# EAGLE design cytron-1 (EAGLE 8.6.1)
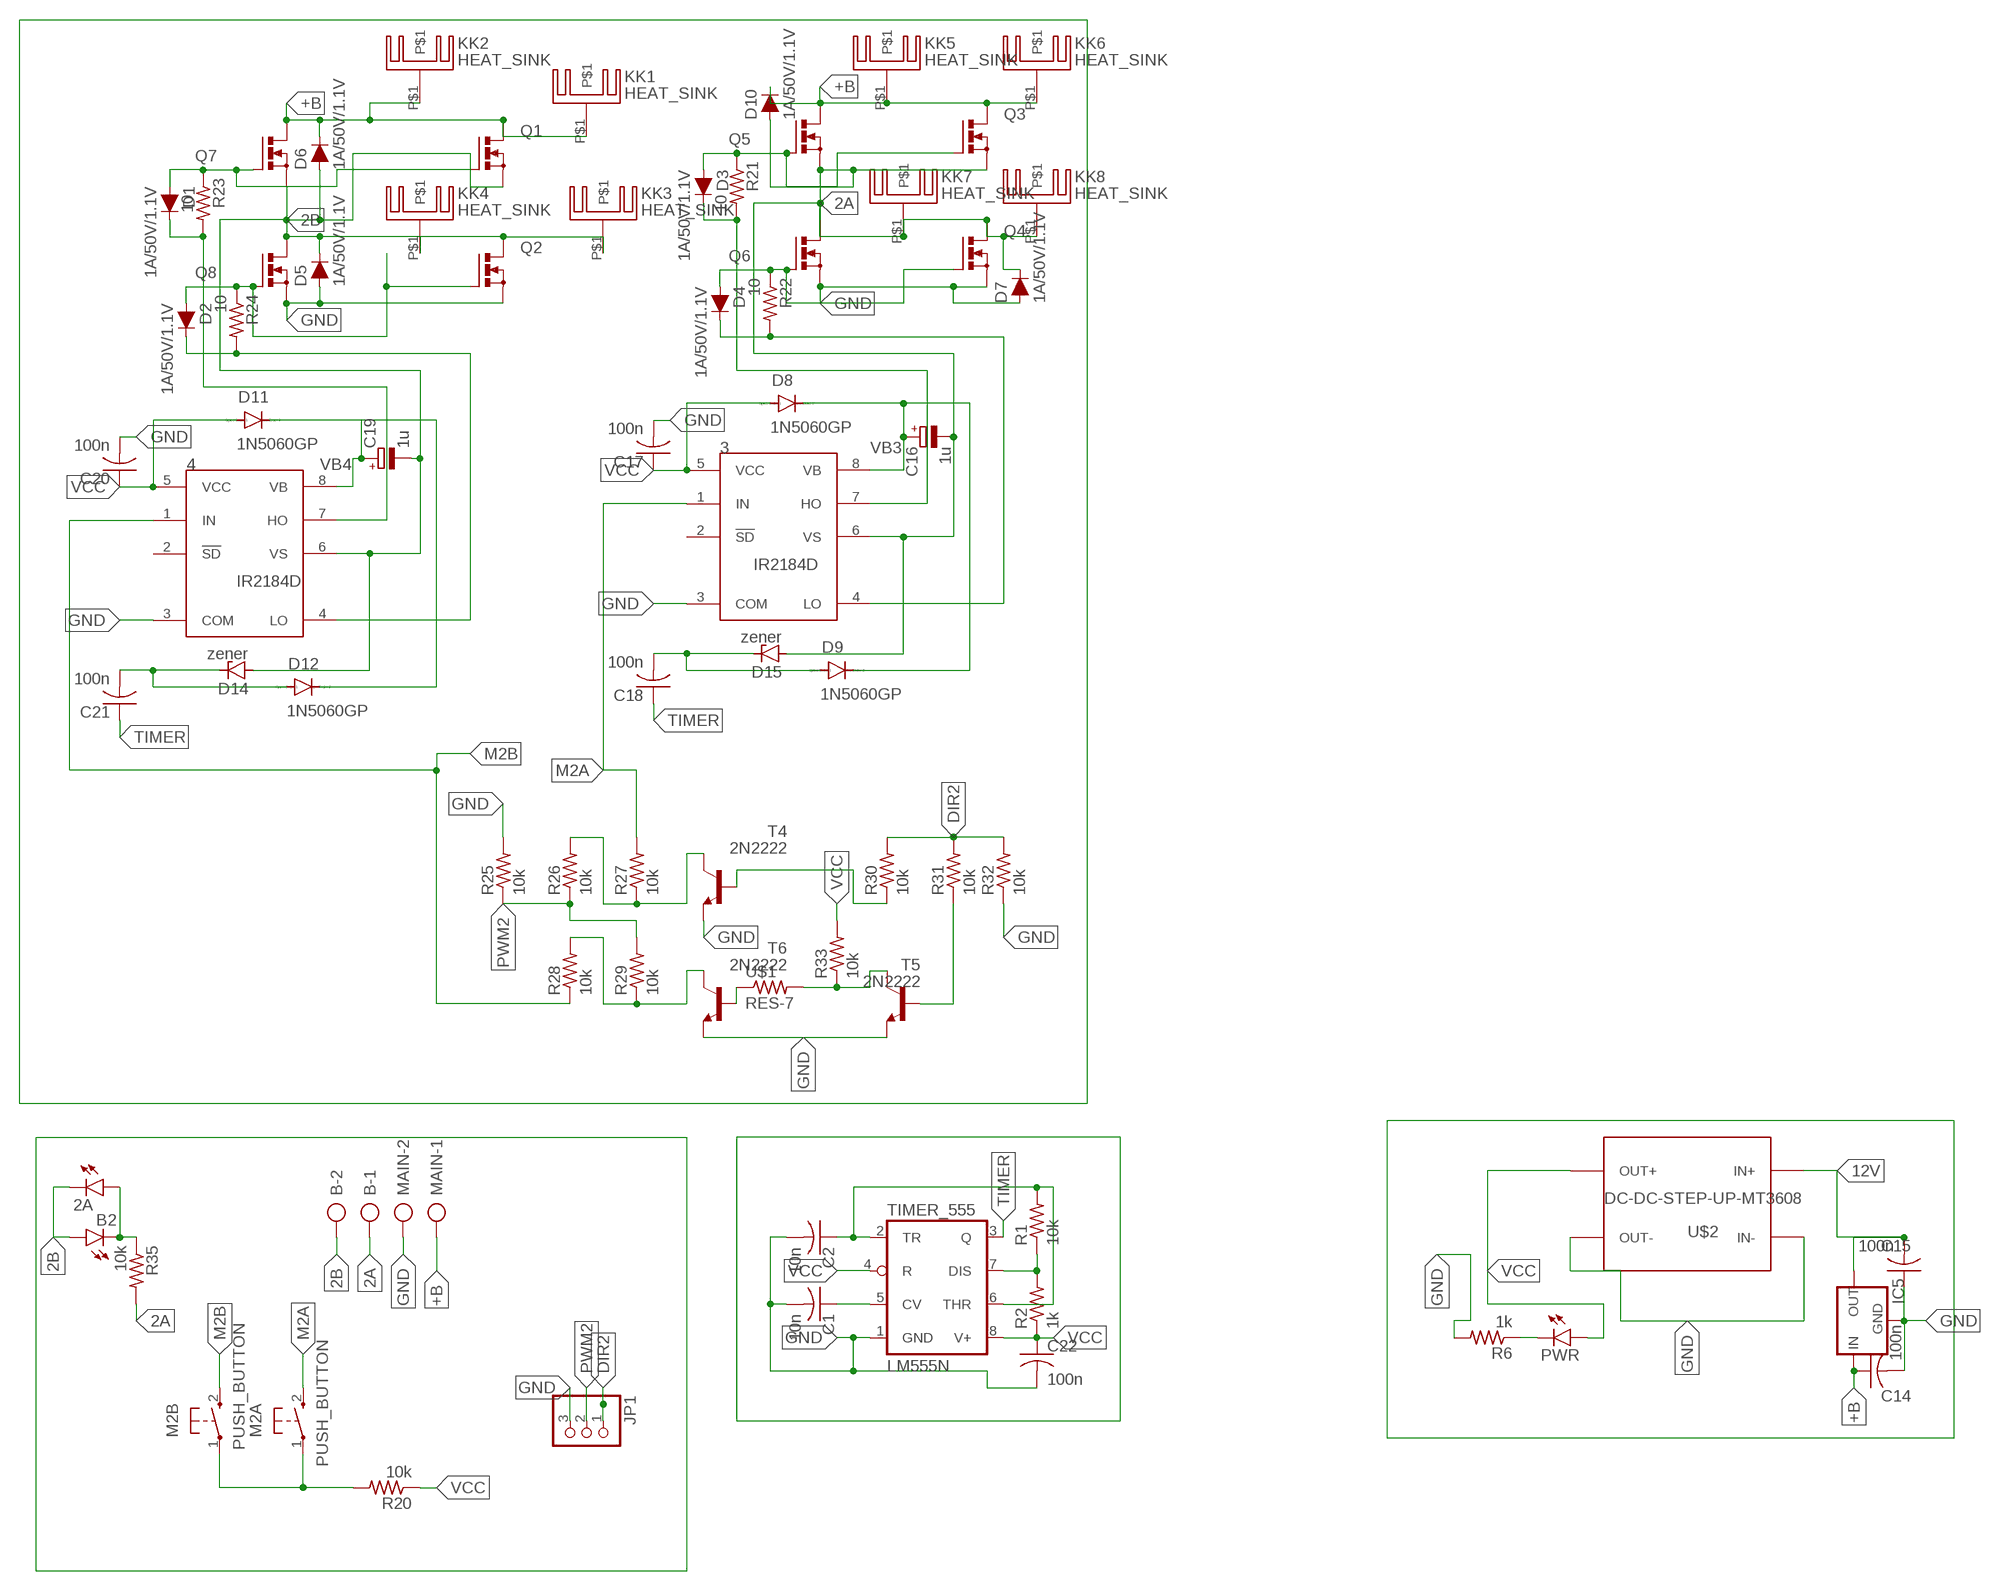
[diagram p0: schematic, sheet 1]

## Parts
2A  LED3MM  [LED3MM]
3  IR2184D  [DIL08]
4  IR2184D  [DIL08]
B  ROSTA.POWER  [W239-302]
B2  LED3MM  [LED3MM]
C1  10n  C-US025-025X050  [C025-025X050]
C2  10n  C-US025-025X050  [C025-025X050]
C14  100n  C-US025-025X050  [C025-025X050]
C15  100n  C-US025-025X050  [C025-025X050]
C16  1u  CPOL-EUE5-5  [E5-5]
C17  100n  C-US025-025X050  [C025-025X050]
C18  100n  C-US025-025X050  [C025-025X050]
C19  1u  CPOL-EUE5-5  [E5-5]
C20  100n  C-US025-025X050  [C025-025X050]
C21  100n  C-US025-025X050  [C025-025X050]
C22  100n  C-US025-025X050  [C025-025X050]
D1  1A/50V/1.1V  DIODE(1A)-PTH  [DIODE-1N4001]
D2  1A/50V/1.1V  DIODE(1A)-PTH  [DIODE-1N4001]
D3  1A/50V/1.1V  DIODE(1A)-PTH  [DIODE-1N4001]
D4  1A/50V/1.1V  DIODE(1A)-PTH  [DIODE-1N4001]
D5  1A/50V/1.1V  DIODE(1A)-PTH  [DIODE-1N4001]
D6  1A/50V/1.1V  DIODE(1A)-PTH  [DIODE-1N4001]
D7  1A/50V/1.1V  DIODE(1A)-PTH  [DIODE-1N4001]
D8  1N5060GP  [DO15-12]
D9  1N5060GP  [DO15-12]
D10  1A/50V/1.1V  DIODE(1A)-PTH  [DIODE-1N4001]
D11  1N5060GP  [DO15-12]
D12  1N5060GP  [DO15-12]
D14  zener  BZD23  [SOD81]
D15  zener  BZD23  [SOD81]
IC5  78XXL  [78XXL]
JP1  PINHD-3_DATA  [1X03_DATA]
KK1  HEAT_SINK  [SK95-2M3]
KK2  HEAT_SINK  [SK95-2M3]
KK3  HEAT_SINK  [SK95-2M3]
KK4  HEAT_SINK  [SK95-2M3]
KK5  HEAT_SINK  [SK95-2M3]
KK6  HEAT_SINK  [SK95-2M3]
KK7  HEAT_SINK  [SK95-2M3]
KK8  HEAT_SINK  [SK95-2M3]
M2A  PUSH_BUTTON  [B3F-10XX]
M2B  PUSH_BUTTON  [B3F-10XX]
MAIN  ROSTA.POWER  [W239-302]
PWR  LED5MM  [LED5MM]
Q1  MOSFET_NTO220BV  [TO220BV]
Q2  MOSFET_NTO220BV  [TO220BV]
Q3  MOSFET_NTO220BV  [TO220BV]
Q4  MOSFET_NTO220BV  [TO220BV]
Q5  MOSFET_NTO220BV  [TO220BV]
Q6  MOSFET_NTO220BV  [TO220BV]
Q7  MOSFET_NTO220BV  [TO220BV]
Q8  MOSFET_NTO220BV  [TO220BV]
R1  10k  R-US_0204/7  [0204/7]
R2  1k  R-US_0204/7  [0204/7]
R6  1k  R-US_0204/7  [0204/7]
R20  10k  R-US_0204/7  [0204/7]
R21  10  R-US_0204/7  [0204/7]
R22  10  R-US_0204/7  [0204/7]
R23  10  R-US_0204/7  [0204/7]
R24  10  R-US_0204/7  [0204/7]
R25  10k  R-US_0204/7  [0204/7]
R26  10k  R-US_0204/7  [0204/7]
R27  10k  R-US_0204/7  [0204/7]
R28  10k  R-US_0204/7  [0204/7]
R29  10k  R-US_0204/7  [0204/7]
R30  10k  R-US_0204/7  [0204/7]
R31  10k  R-US_0204/7  [0204/7]
R32  10k  R-US_0204/7  [0204/7]
R33  10k  R-US_0204/7  [0204/7]
R35  10k  R-US_0204/7  [0204/7]
T4  2N2222  [TO18]
T5  2N2222  [TO18]
T6  2N2222  [TO18]
TIMER_555  LM555N  [DIL08]
U$1  RES-7  [0204/7]
U$2  DC-DC-STEP-UP-MT3608  [DC-DC-STEP-UP-MT3608]

## Nets
2A: 3.6(VS) B.1 C16.- D7.C D10.A D15.A KK7.P$1 KK8.P$1 Q3.S Q4.D Q5.S Q6.D R35.2
2B: 2A.K(C) 4.6(VS) B2.A B.2 C19.- D5.C D6.A D14.A KK3.P$1 KK4.P$1 Q1.S Q2.D Q7.S Q8.D
12V: C15.2 IC5.OUT U$2.IN+
+B: C14.1 D6.C D10.C IC5.IN KK1.P$1 KK2.P$1 KK5.P$1 KK6.P$1 MAIN.1 Q1.D Q3.D Q5.D Q7.D
DIR2: JP1.1 R30.2 R31.2 R32.2
GND: 3.3(COM) 4.3(COM) C1.2 C2.2 C14.2 C15.1 C17.2 C20.2 C22.2 D5.A D7.A IC5.GND JP1.3 MAIN.2 Q2.S Q4.S Q6.S Q8.S R6.2 R25.2 R32.1 T4.1(E) T5.1(E) T6.1(E) TIMER_555.1(GND) U$2.IN- U$2.OUT-
M2A: 3.1(IN) M2A.2(S) R27.2
M2B: 4.1(IN) M2B.2(S) R28.1
N$1: PWR.K(C) R6.1
N$2: C1.1 TIMER_555.5(CV)
N$3: R1.1 R2.2 TIMER_555.7(DIS)
N$4: C2.1 R1.2 TIMER_555.2(TR) TIMER_555.6(THR)
N$6: D4.A Q4.G Q6.G R22.1
N$7: M2A.1(P) M2B.1(P) R20.2
N$8: T6.2(B) U$1.1
N$25: D3.A Q3.G Q5.G R21.1
N$26: 3.4(LO) D4.C R22.2
N$30: 3.7(HO) D3.C R21.2
N$31: C18.2 D9.A D15.C
N$32: D2.A Q2.G Q8.G R24.1
N$33: D1.A Q1.G Q7.G R23.1
N$34: 4.4(LO) D2.C R24.2
N$35: 4.7(HO) D1.C R23.2
N$36: C21.2 D12.A D14.C
N$37: R28.2 R29.1 T6.3(C)
N$38: R26.2 R27.1 T4.3(C)
N$39: R30.1 T4.2(B)
N$40: R33.1 T5.3(C) U$1.2
N$41: R31.1 T5.2(B)
N$46: 2A.A B2.K(C) R35.1
PWM2: JP1.2 R25.1 R26.1 R29.2
TIMER: C18.1 C21.1 TIMER_555.3(Q)
VB3: 3.8(VB) C16.+ D8.C D9.C
VB4: 4.8(VB) C19.+ D11.C D12.C
VCC: 3.5(VCC) 4.5(VCC) C17.1 C20.1 C22.1 D8.A D11.A PWR.A R2.1 R20.1 R33.2 TIMER_555.4(R) TIMER_555.8(V+) U$2.OUT+
Unconnected: 3.2(!SD) 4.2(!SD)

## Library data of the parts
2A B2 PWR = led:LED: LED OSRAM: - CHIPLED LG R971, LG N971, LY N971, LG Q971, LY Q971, LO R971, LY R971 LH N974, LH R974 LS Q976, LO Q976, LY Q976 LO Q996 - Hyper CHIPLED LW Q18S LB Q993, LB Q99A, LB R99A - SideLED LS A670, LO A670, LY A670, LG A670, LP A670 LB A673, LV A673, LT A673, LW A673 LH A674 LY A675 LS A676, LA A676, LO A676, LY A676, LW A676 LS A679, LY A679, LG A679 - Hyper Micro SIDELED® LS Y876, LA Y876, LO Y876, LY Y876 LT Y87S - SmartLED LW L88C, LW L88S LB L89C, LB L89S, LG L890 LS L89K, LO L89K, LY L89K LS L896, LA L896, LO L896, LY L896 - TOPLED LS T670, LO T670, LY T670, LG T670, LP T670 LSG T670, LSP T670, LSY T670, LOP T670, LYG T670 LG T671, LOG T671, LSG T671 LB T673, LV T673, LT T673, LW T673 LH T674 LS T676, LA T676, LO T676, LY T676, LB T676, LH T676, LSB T676, LW T676 LB T67C, LV T67C, LT T67C, LS T67K, LO T67K, LY T67K, LW E67C LS E67B, LA E67B, LO E67B, LY E67B, LB E67C, LV E67C, LT E67C LW T67C LS T679, LY T679, LG T679 LS T770, LO T770, LY T770, LG T770, LP T770 LB T773, LV T773, LT T773, LW T773 LH T774 LS E675, LA E675, LY E675, LS T675 LS T776, LA T776, LO T776, LY T776, LB T776 LHGB T686 LT T68C, LB T68C - Hyper Mini TOPLED® LB M676 - Mini TOPLED Santana® LG M470 LS M47K, LO M47K, LY M47K Source: http://www.osram.convergy.de LUXEON: - LUMILED® LXK2-PW12-R00, LXK2-PW12-S00, LXK2-PW14-U00, LXK2-PW14-V00 LXK2-PM12-R00, LXK2-PM12-S00, LXK2-PM14-U00 LXK2-PE12-Q00, LXK2-PE12-R00, LXK2-PE12-S00, LXK2-PE14-T00, LXK2-PE14-U00 LXK2-PB12-K00, LXK2-PB12-L00, LXK2-PB12-M00, LXK2-PB14-N00, LXK2-PB14-P00, LXK2-PB14-Q00 LXK2-PR12-L00, LXK2-PR12-M00, LXK2-PR14-Q00, LXK2-PR14-R00 LXK2-PD12-Q00, LXK2-PD12-R00, LXK2-PD12-S00 LXK2-PH12-R00, LXK2-PH12-S00 LXK2-PL12-P00, LXK2-PL12-Q00, LXK2-PL12-R00 Source: www.luxeon.com KINGBRIGHT: KA-3528ASYC Source: www.kingbright.com
3 4 = irs:IR2184
B MAIN = MIA_LIBRARY-2-2-2:ROSTA.POWER: WAGO SCREW CLAMP; OC_FARNELL: unknown; OC_NEWARK: unknown
C1 C2 C14 C15 C17 C18 C20-C22 = rcl8:C-US: CAPACITOR, American symbol; SPICEPREFIX: C
C16 C19 = rcl8:CPOL-EU: POLARIZED CAPACITOR, European symbol; SPICEPREFIX: C
D1-D7 D10 = MIA_LIBRARY-2-2-2:DIODE(1A): Diode These are standard reverse protection diodes and small signal diodes. SparkFun Products: SparkFun SparkPunk Sound Kit <https://www.sparkfun.com/products/11177> SparkFun ESP8266 Thing <https://www.sparkfun.com/products/13231>; PROD_ID: DIO-09176
D8 D9 D11 D12 = diode:1N5060GP: DIODE controlled avalanche rectifier
D14 D15 = diode:BZD23: Z DIODE
IC5 = MIA_LIBRARY-2-2-2:78XXL: VOLTAGE REGULATOR
JP1 = MIA_LIBRARY-2-2-2:PINHD-3_DATA: PIN HEADER
KK1-KK8 = MIA_LIBRARY-2-2-2:HEAT_SINK: HEATSINK manufacturer Fischer/distributor Buerklin
M2A M2B = MIA_LIBRARY (1):PUSH_BUTTON: OMRON SWITCH
Q1-Q8 = MIA_LIBRARY-2-2-2:MOSFET_N: Power MOSFET N-Channel
R1 R2 R6 R20-R33 R35 = rcl8:R-US_: RESISTOR, American symbol; SPICEPREFIX: R
T4-T6 = transistor:2N2222: NPN TRANSISTOR
TIMER_555 = linear:*555: TIMER
U$1 = MIA_LIBRARY-2-2-2:RES-7
U$2 = MIA_LIBRARY-2-2-2:DC-DC-STEP-UP-MT3608: DC/DC Step-Up Regulator based on MT3608 chip MT3608 datasheet available here: https://www.olimex.com/Products/Breadboarding/BB-PWR-3608/resources/MT3608.pdf Click here to find device on ebay.com <http://www.ebay.com/sch/mt3608+module>

## Board
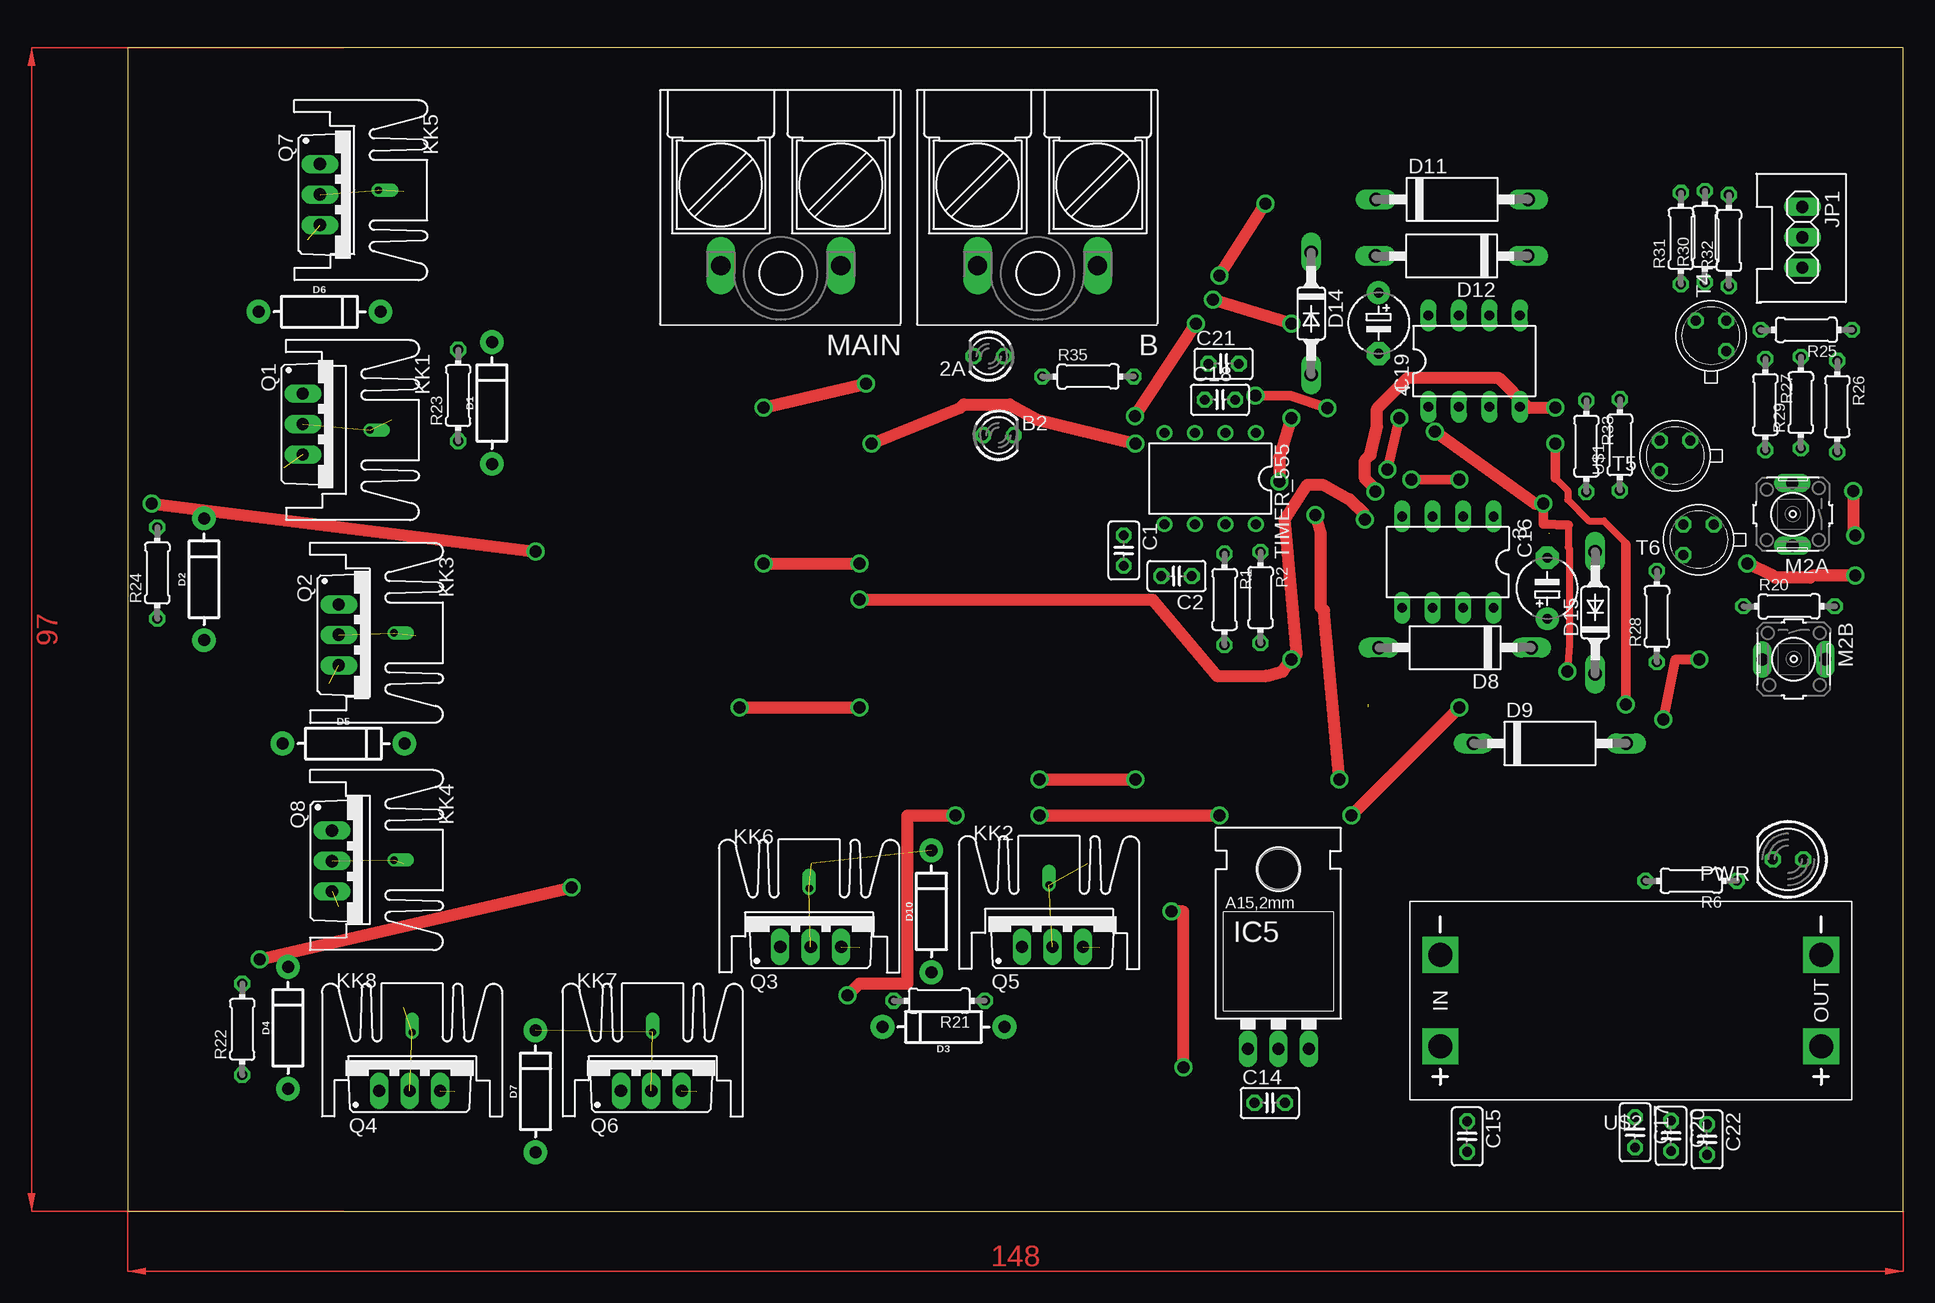
[diagram p1: board, top side]
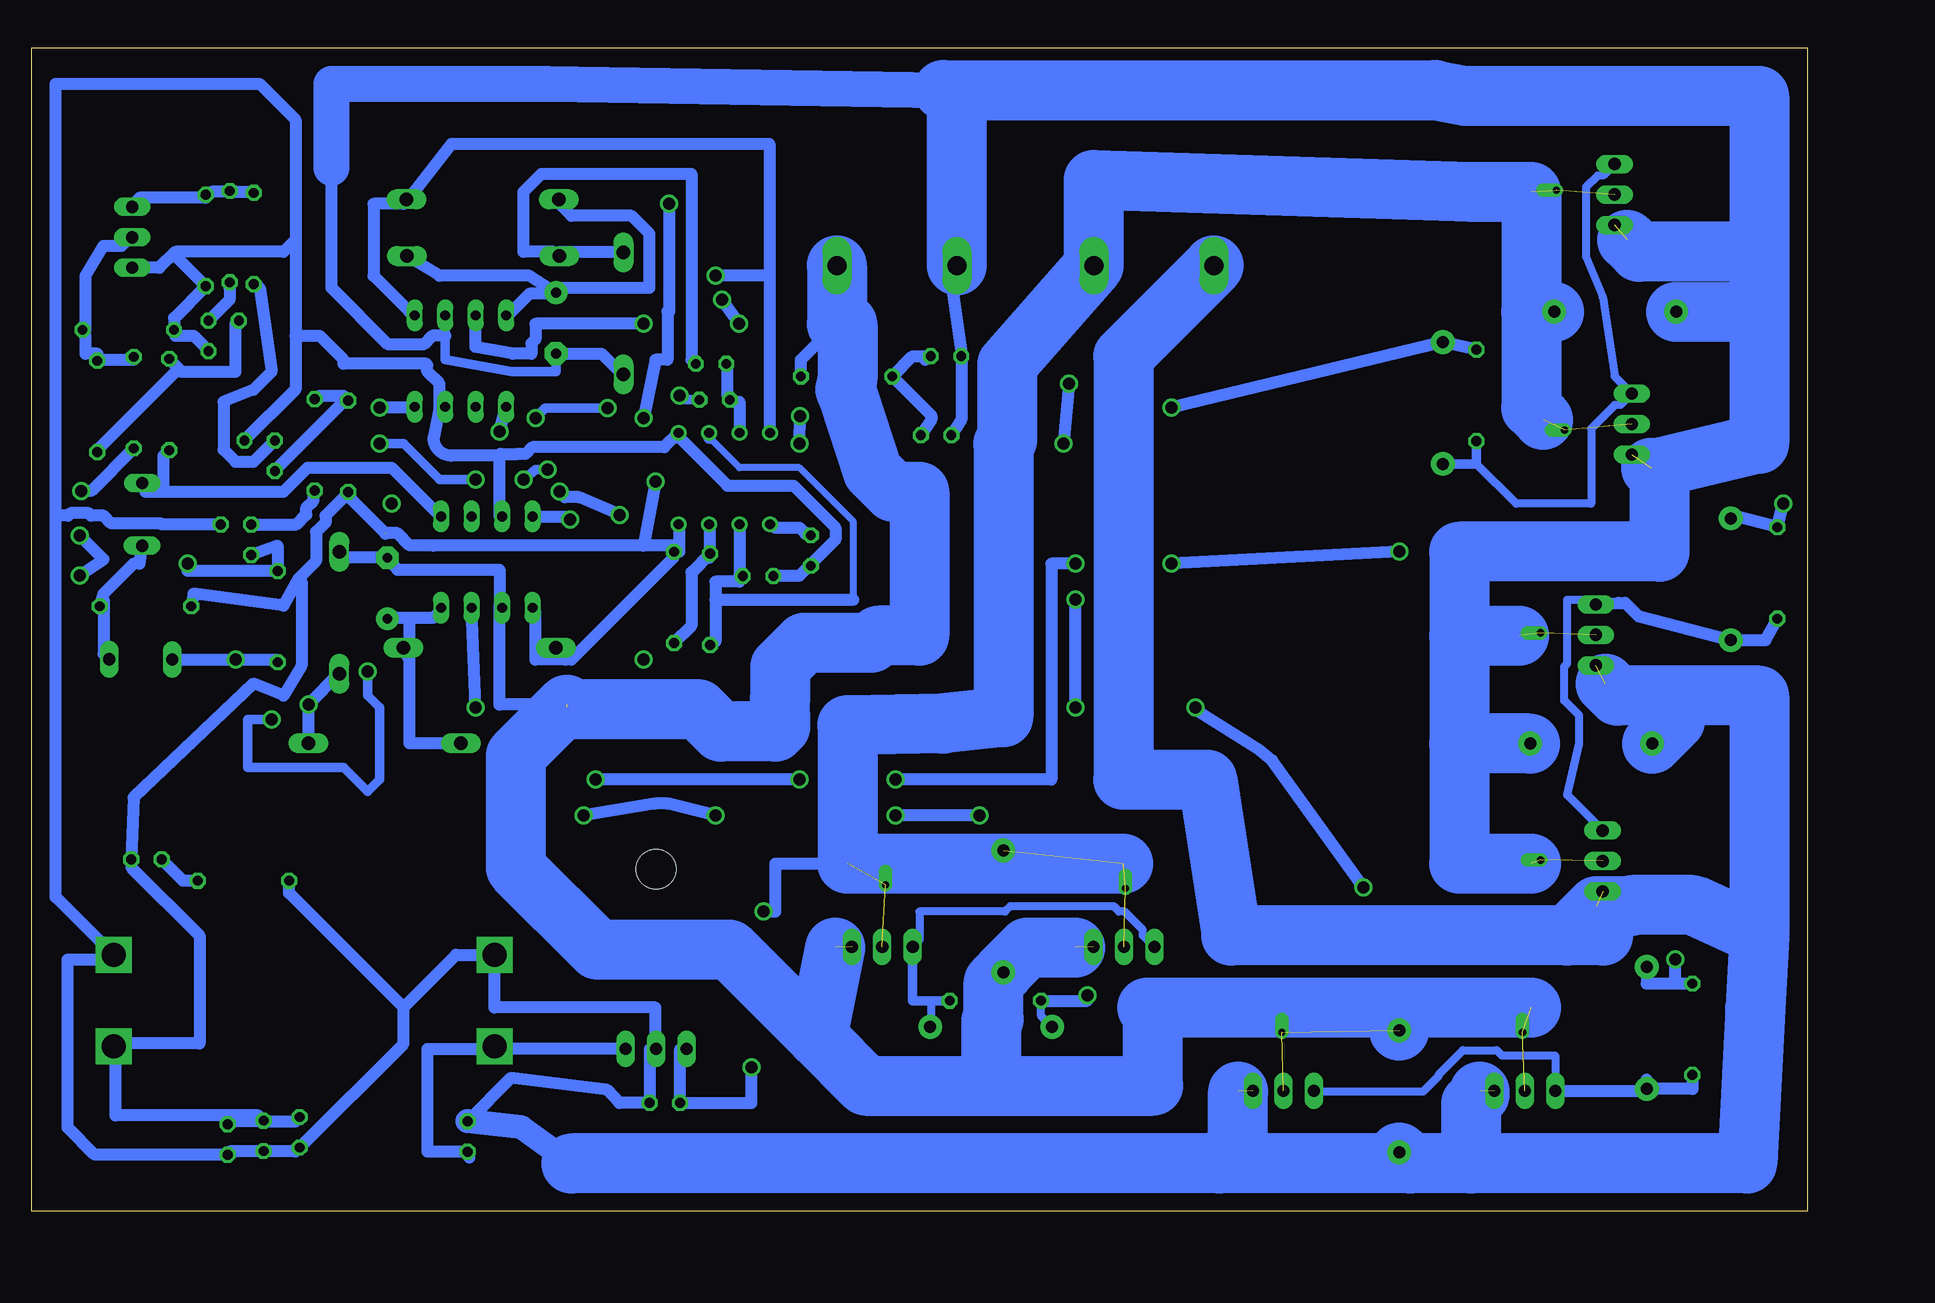
[diagram p2: board, bottom side, seen from below]

Size 148 x 97 mm. Coordinates in mm from the lower left corner, seen from the top.
Outline: 0,0 148,0 148,97 0,97 0,0
Copper layers (1*16): Top 0.035mm / dielectric 1.5mm / Bottom 0.035mm
Design rules "default *": minimum track width 1mm, minimum drill 0.35mm, track to track 0.6mm, track to pad 0.5mm, pad to pad 0.5mm, via to via 0.6mm, smd to smd 6mil, copper to edge 40mil, drill to drill 6mil, minimum pad ring 10mil, minimum via ring 8mil, stop-mask expansion 4mil, vias tented up to drill 0mil, thermal gap 10mil

### Footprints (pad centres in the part's own frame; a part is rotated, then mirrored left to right if it is on the bottom)
LED3MM = drill 0.813 octagon: A -1.27,0; K 1.27,0
DIL08 = drill 0.813 long: 1 -3.81,-3.81; 2 -1.27,-3.81; 3 1.27,-3.81; 4 3.81,-3.81; 5 3.81,3.81; 6 1.27,3.81; 7 -1.27,3.81; 8 -3.81,3.81
W239-302 = drill 1.6 long: 1 -5,5; 2 5,5
C025-025X050 = drill 0.813 octagon: 1 -1.27,0; 2 1.27,0
E5-5 = drill 0.813 pad 1.905: + -2.54,0 | drill 0.813 pad 1.905 octagon: - 2.54,0
DIODE-1N4001 = drill 1 pad 1.981: A -5.08,0; C 5.08,0
DO15-12 = drill 1.118 long: A 6.35,0; C -6.35,0
SOD81 = drill 1.118 long: A 5.08,0; C -5.08,0
78XXL = drill 1.016 long: GND 0,-3.81; IN -2.54,-3.81; OUT 2.54,-3.81 | hole 3.302: 0,11.176
1X03_DATA = drill 1.016 long: 1 -2.54,0; 2 0,0; 3 2.54,0
SK95-2M3 = drill 0.6 offset: P$1 0,2
B3F-10XX = drill 1.016 long: 1 0.013,2.636; 2 0.029,-2.605
LED5MM = drill 0.813 octagon: A -1.27,0; K 1.27,0
TO220BV = drill 1.016 long: D 0,-2.54; G -2.54,-2.54; S 2.54,-2.54
0204/7 = drill 0.813 octagon: 1 -3.81,0; 2 3.81,0
TO18 = drill 0.813 octagon: 1 -1.27,-1.27; 2 1.27,-1.27; 3 1.27,1.27
DIL08' = drill 0.813 pad 1.27: 1 -3.81,-3.81; 2 -1.27,-3.81; 3 1.27,-3.81; 4 3.81,-3.81; 5 3.81,3.81; 6 1.27,3.81; 7 -1.27,3.81; 8 -3.81,3.81
DC-DC-STEP-UP-MT3608 = drill 2 pad 2.8 square: IN+ 15.24,3.81; IN- 15.24,-3.81; OUT+ -16.51,3.81; OUT- -16.51,-3.81

### Placement (x,y rotation side)
2A  71.78,71.29 180 top
3  110.05,54.12 180 top
4  112.25,70.88 0 top
B  75.86,83.84 180 top
B2  72.6,64.71 0 top
C1  83.04,55.09 270 top
C2  87.44,52.96 180 top
C14  95.21,9.04 0 top
C15  111.66,6.24 270 top
C16  118.34,51.94 90 top
C17  125.66,6.59 270 top
C18  91.06,67.66 0 top
C19  104.28,74.05 270 top
C20  128.66,6.29 270 top
C21  91.36,70.66 0 top
C22  131.66,5.99 270 top
D1  30.37,67.39 90 top
D2  6.37,52.69 90 top
D3  68.01,15.37 180 top
D4  13.37,15.29 90 top
D5  18,39 0 top
D6  16,75 0 top
D7  34,10 90 top
D8  110.66,46.99 180 top
D9  118.56,39.01 0 top
D10  67,25 90 top
D11  110.41,84.36 0 top
D12  110.37,79.64 180 top
D14  98.66,74.85 270 top
D15  122.34,49.91 90 top
IC5  95.94,17.35 0 top
JP1  139.61,81.2 270 top
KK1  18.21,65.13 270 top
KK2  76.82,25.21 0 top
KK3  20.21,48.23 270 top
KK4  20.21,29.28 270 top
KK5  18.91,85.13 270 top
KK6  56.82,24.91 0 top
KK7  43.77,12.91 0 top
KK8  23.72,12.91 0 top
M2A  138.8,58.12 180 top
M2B  138.88,46.04 270 top
MAIN  54.45,83.84 180 top
PWR  138.42,29.34 180 top
Q1  17.15,65.63 270 top
Q2  20.15,48.06 270 top
Q3  56.95,24.58 0 top
Q4  23.52,12.58 0 top
Q5  77.09,24.58 0 top
Q6  43.66,12.58 0 top
Q7  18.58,84.77 270 top
Q8  19.58,29.2 270 top
R1  91.44,51.02 270 top
R2  94.44,51.18 270 top
R6  130.34,27.56 180 top
R20  138.5,50.44 0 top
R21  67.66,17.56 180 top
R22  9.56,15.18 90 top
R23  27.56,68.02 90 top
R24  2.48,53.22 90 top
R25  139.94,73.48 180 top
R26  142.52,67.1 270 top
R27  136.52,67.26 270 top
R28  127.48,49.58 90 top
R29  139.48,67.42 90 top
R30  131.48,81.26 90 top
R31  129.48,81.1 90 top
R32  133.48,80.94 90 top
R33  121.6,63.78 270 top
R35  80.06,69.6 0 top
T4  131.99,72.98 90 top
T5  128.99,62.99 180 top
T6  130.96,55.99 180 top
TIMER_555  LM555N  [DIL08']  90.25,61.09 180 top
U$1  124.4,63.9 90 top
U$2  124.66,17.57 180 top

### Tracks (layer width: path | path; a pad name or v marks a point on that pad's centre or on a via)
2A  (7 unrouted)
  Bottom 1: 109,50.5 109,53.5 117.5,53.5 118,54 C16.- 118.5,54.5 122,54.5 D15.A | 109,50.5 3.6 | 103.38,42.25 109,42.25 109,50.5 | R35.2 83.87,70.99 80.86,74
  Bottom 5: B.1 80.86,74 80,74 80,69.32 80.18,68.55 80.13,68.41 80.13,68.39 79.9,67.82 77.9,61.71 76.19,60 74,60 74,48 77.41,48 78.01,47.4 83.6,47.4 85.6,45.4 85.6,42.76 85.64,42.72 85.6,40.45 85.6,40.4 86,40 90.56,40 92.41,41.85 103.18,41.85 103.38,42.05 | 103.38,42.25 107.63,38 107.63,28.63 100.83,21.84 89.83,21.84 82.5,14.5 | 68,10.48 78.48,10.48 82.5,14.5 | 68,10.48 54.52,10.48 54.52,16.52 55,17 34,17 | 82.5,14.5 81,22 | 68,10.48 68,15.85 67.81,16.04 67.81,19.11 D10.A 67,20 65,22 61,22 | 34,17 23,17 | D7.C 34,17
2B  (6 unrouted)
  Bottom 0.8: 4.6 113.52,73 113.52,71 108,70 104.28,70 C19.-
  Bottom 1: D14.A 99,70 100.5,71.5 104,71.5 C19.- | B2.A 70.5,66 70.5,71 2A.K 70.5,71.5 71.5,78.5 71,78.5 B.2 70.5,79 | 123,87 123,77 118.27,72.27 115.33,72.27 114.6,73 113.52,73
  Bottom 3: 123,87 123,94 105,94 72,93.48
  Bottom 5: B.2 70.86,92.62 72,93.48 31,93.48 28.52,93 4,93 4,80 | 4,80 4,75 | 4,75 4,64 12.3,62 | 12.3,62 12.33,61.97 13,61.97 | 4,80 14,80 15,81 | 29,48 29,55 12.3,55 12.3,62 | 29,48 29,39 | 29,39 29,29 23,29 | D6.A 4,75 | 29,48 24,48 | D5.C 29,39
12V
  Bottom 1: 111.5,4.5 C15.2 115,4.97 115,13.54 109.42,13.54 | IC5.OUT 109.42,13.54 | 109.42,13.54 U$2.IN+
+B  (via drill 1)  (9 unrouted)
  Top 1: v88,12 88,25 v87,25
  Bottom 1: IC5.IN 93.94,13.54 C14.1 88,9.04 v88,12 | v87,25 86,25 86,29 80,29
  Bottom 5: 57,29 80,29 80,40.51 72,40.66 72.07,40.66 67,41.2 67,64 66.69,64.32 66.69,70.61 MAIN.1 59.45,86 28,85 23,85 23,75 | 22,66 23,67 23,75 | D6.C 23,75
DIR2
  Bottom 1: R31.2 129.5,85 131,85 R30.2 131.5,85 133,85 R32.2 133.5,84.5 139,84.5 139.5,84 JP1.1
GND  (4 unrouted)
  Bottom 1: T4.1 133.5,72 134.5,73 136,73 R25.2 136.13,74.48 R32.1 136,79.65 136,80 | C2.2 86,53 84,53 83.5,53.5 C1.2 83,54 81,56 81,57 84.5,60.5 90,60.5 94,64.5 TIMER_555.1 | 114,67 114.5,64.5 arc-90 113,63 109,63 | 114,67 4.3 | 94.5,64.5 TIMER_555.1 | 111,7.5 C15.1 108.05,11.12 100,10.12 99,9.04 C14.2 96.48,13.54 IC5.GND 96,13.54 96,17 109.42,17 U$2.IN- 112.62,21.38 117,17 | 117,17 117,13.98 C17.2 126,5 128.5,5 C20.2 129,5 131.5,5 C22.2 142.72,4.72 145,7 145,21 141.55,21 U$2.OUT- 146,26.21 146,58 | 117,17 126.53,26.53 R6.2 | 146,58 146,94 129,94 126,91 126,81 | 126,81 127,80 136,80 | 136,80 137.34,78.66 JP1.3 | T5.1 126,68.52 126,73 | 126,81 126,73 | 126,73 124,73 122,71 122,70.67 115.1,70.67 115.11,70.66 115.02,70.53 115.02,70.02 114,69 114,67 | 107.54,63.15 107.57,63.12 | 108.65,58.35 109,58 3.3 arc90 109,58.15 109,63 | 109,63 arc90 108.85,63.15 107.54,63.15 | T6.1 137.17,57.26 137.25,57.35 141.35,57.35 142,58 143.03,58 143.23,58.2 144.77,58.2 144.97,58 146,58 | 107.54,63.15 106.82,63.15 106.27,63.7 95.26,63.7 TIMER_555.1
  Bottom 2: 103,4 107.15,7 C15.1
  Bottom 5: 4,23 4,43 11,43 | 4,23 4.32,16.91 5,4 28,4 | 28,4 33.08,4 | 33.08,4 49,4 | 49,4 103,4 | 4,23 9.54,25.54 14.62,25.54 14.72,25.44 17.56,25.44 20,23 | 11,43 15.81,43 16.81,44 | MAIN.2 57,71.29 57,36 50,36 48,23 20,23 | 17,23 20,23 | D5.A 11,40.92 11,43 | 49,4 47.42,5.58 47.42,10 | 28,4 28,9 27.28,9.72 27.28,10 | D7.A 33.08,4
M2A
  Bottom 1: 137,60 138.5,60 M2A.2 | 137,60 127,60 125,62 118,62 114,58 3.1 | 137,60 137,63 R27.2
M2B  (via drill 1)
  Top 0.6: 120.09,57.21 120.09,55.35 120.19,55.25 120.19,47.19 v120,45
  Top 0.8: 117.32,59 v118,59 118,57.3 120.09,57.21 | v128,41 129,46 v131,46
  Top 1: 117.32,59 v108.99,64.99
  Bottom 0.8: v120,45 120,43 119,42 119,36 120,35 122,37 130,37 130,41 v128,41
  Bottom 1: R28.1 127.5,46 v131,46 136,46 M2B.2 | v108.99,64.99 4.1
N$1
  Bottom 1: R6.1 135.37,27.56 PWR.K
N$2
  Bottom 1: C1.1 83.5,56.5 84,57 86,57 TIMER_555.5
N$3
  Bottom 1: R1.1 91.5,55 91.5,57 TIMER_555.7 | 91.5,54.5 R1.1 | R1.1 93,53.27 93,48.81 R2.2
N$4
  Bottom 0.6: 91.5,64.5 89,62 84,62 79.5,57.5 79.5,51
  Bottom 1: TIMER_555.6 89,57 89,53 C2.1 89,52.5 91,52.5 91,51 | 91,51 91,47.5 R1.2 | 91,51 79.5,51 | 91.5,64.5 TIMER_555.2
N$6
  Bottom 0.65: Q6.G 41.08,10 32,10 30.71,11.29 30.71,11.42 28.7,13.43 25.86,13.43 25.44,13 21,13 21,10.06 Q4.G
  Bottom 1: Q4.G 13.37,10.04 D4.A | 13.37,11 D4.A | R22.1 9.56,10.21 D4.A
N$7
  Bottom 1: M2A.1 139,54 139.5,54 142,51.5 R20.2 142,51 142,46.5 M2B.1
N$8
  Bottom 1: U$1.1 124.5,60 124.5,59.26 125.1,58.66 125.1,58.07 125.91,57.26 T6.2
N$25
  Bottom 0.65: Q3.G 55.36,22.99 55.36,23.46 56.9,25 57.37,25 57.8,25.43 66.42,25.43 66.84,25 74,25 74,22.59 Q5.G | D3.A 73,15.46 73,17.56
  Bottom 0.8: Q5.G 74.55,17.56 73,17.56 R21.1
N$26  (via drill 1)
  Top 1: v11,21 v37,27 | v51,42 v61,42 | v61,51 85.44,51 90.79,44.65 94.93,44.65 96.28,45 v97,46 97.46,46.46 96.46,57.67 98.36,60.58 99.64,60.58 101.86,59.35 103.13,58.08 v103.13,57.69
  Bottom 0.8: 106.17,58 3.4
  Bottom 1: D4.C 13.37,18.99 11,18.99 | 11,18.99 R22.2 | 11,18.99 v11,21 | v37,27 44.6,37.6 45.6,38.41 51,41.81 v51,42 | v61,42 v61,51 | 3.4 103.13,57.93 v103.13,57.69
N$30  (via drill 1)
  Top 1: v76,33 v91,33 | v102,33 v111,42 | v60,18 61,19 65,19 65,33 v69,33
  Bottom 0.65: D3.C 63.85,16.29 R21.2
  Bottom 1: v69,33 v76,33 | v91,33 95,34 96,34 v102,33 | v111,42 3.7 | R21.2 60,17.56 v60,18
N$31  (via drill 1)
  Top 0.6: 119,61.14 120.04,60.1 120.04,59.32 121.8,57.57 123.06,57.57 124.91,55.72 124.91,55.58
  Top 0.8: v94,68 96.94,68 v100,66.94 | v106,66.15 v105,61.85 | v107,61 v111,61 | v119,64 119,61.14 | 124.91,55.58 v124.91,42.26
  Bottom 0.8: C18.2 93.66,67.66 v94,68 | v100,66.94 105.21,66.94 v106,66.15 | v105,61.85 106,61.85 v107,61 | v111,61 114,61 117,64 v119,64
  Bottom 1: D9.A v124.91,42.26 D15.C
N$32
  Bottom 0.65: Q8.G 20,34.7 19,39 19,41.35 20.23,42.58 20.23,45.42 20,45.65 20,51 18.01,51 Q2.G
  Bottom 1: Q2.G 15.73,50.72 15.16,50.72 14.05,49.61 D2.A 3.48,47.61 R24.1
N$33
  Bottom 0.65: Q7.G 16.99,86.36 17.46,86.36 18.43,85.39 18.43,79.58 17.04,76.2 16.04,69.6 Q1.G 15.56,67.22 16.03,67.22 18,65.25 18,59 24.25,59 27.56,62.31
  Bottom 0.8: D1.A 27.56,62.31 R23.1
N$34  (via drill 1)
  Top 1: v2,59 v34,55 | v53,54 v61,54 | v76,36 v84,36 | v101,36 99.73,50.1 99.46,50.36 99.46,56.58 v99,58.04 | v104,60 104,60.23 103.15,61.08 103.15,62.62 103.61,63.08 104.15,65.38 104.15,66.92 106.72,69.49 114.25,69.49 116.74,67 v119,67
  Bottom 1: D2.C 6.37,58.03 R24.2 v2,59 | v34,55 v53,54 | v61,54 63,54 63,36 v76,36 | v84,36 v101,36 | v99,58.04 98.86,58.04 102.36,59.54 103.54,59.54 v104,60 | 4.4 116.06,67 v119,67
N$35  (via drill 1)
  Top 1: v53,67 v61.54,69 | v62,64 69.41,67 69.68,67.27 73.52,67.27 75.79,66 v84,64 | v83.96,66.29 v89.04,74 | v90.46,76 v97,74
  Bottom 1: R23.2 D1.C v53,67 | v61.54,69 v62,64 | v84,64 v83.96,66.29 | v89.04,74 v90.46,76 | v97,74 106,74 106,72.69 106.33,72.36 106.33,71.5 107.86,71.5 110.99,72.07 4.7
N$36
  Bottom 1: C21.2 93,71 93,86.5 105.5,86.5 107,85 107,80 104.5,80 D12.A 104,80 99,80 D14.C
N$37  (via drill 1)
  Top 1: v144,56.35 143.85,56.5 v143.85,60.05 | v144,53 140.42,53 140.24,52.82 137.34,52.82 137.16,53 v135,54
  Bottom 1: T6.3 127.5,55.5 127.5,53.5 R28.2 135,53.39 v135,54 | v144,56.35 142,54.35 v144,53 | R29.1 143.04,60.05 v143.85,60.05
N$38
  Bottom 1: 135.75,70.25 136.5,71 R27.1 | 135.75,70.25 135.5,70 131,70 131,74 T4.3 | 135.75,70.25 142.5,63.5 R26.2
N$39
  Bottom 1: T4.2 133,74.5 131.5,76 131.5,77 R30.1
N$40
  Bottom 1: U$1.2 124,68 122,68 R33.1 122,67.5 127.5,62 T5.3
N$41
  Bottom 1: T5.2 128,64 129.5,62.5 131,62.5 132,63.5 132,67.5 129.5,68.5 128,70 129,77 R31.1
N$46
  Bottom 1: B2.K 73,66 73,66.35 R35.1 74.56,71.29 2A.A 73.5,71
PWM2
  Bottom 1: R29.2 139.5,71 142.5,71 R26.1 142.5,71.5 143.5,71.5 143.5,73 R25.1 143.5,73.5 143.5,78 142,80.5 140.5,80.5 140,81 JP1.2
TIMER
  Bottom 1: TIMER_555.3 89,65 89,67.5 89.5,67.5 C18.1 90,68 90,70.5 C21.1
VB3
  Bottom 1: 116.5,49.5 118,49.5 C16.+ | 116.5,49.5 114.5,49.5 114,50 3.8 | 116.5,46 116.5,49.5 | 116.5,46 D8.C | D9.C 116.5,39.01 116.5,46
VB4
  Bottom 1: 4.8 108,75 106.5,76.5 104.5,76.5 C19.+ | D12.C 116.5,79.5 114,78 106.5,78 C19.+ | D11.C 104,84 103,83 98,83 96.5,81.5 96.5,77 104,77 C19.+
VCC  (via drill 1)  (1 unrouted)
  Top 1: v91,78 v94.85,84 | v97,66.15 96,62.85 v96,60.85
  Bottom 1: 86.5,78 86.5,89 113,89 116.5,84.5 D11.A 117,84 119.5,84 119.5,78 116.5,75 4.5 | 86.5,78 86.5,65 TIMER_555.4 | C22.1 131.5,7.5 129,7.5 C20.1 | C17.1 126,7.5 128.5,7.5 C20.1 | 125.75,52.75 127,50.5 134.5,51.5 R20.1 | TIMER_555.8 94,57 94,55 R2.1 | 3.5 106,50 106,46 103.5,46 D8.A 103,46 94.5,54.5 R2.1 | 118.5,56.5 121.5,59.5 R33.2 122,59.5 123.5,58 123.5,57.41 124.28,56.63 124.28,54.22 125.75,52.75 | 97,55.5 94.5,55.5 R2.1 | 97,55.5 114.5,55.5 114.51,55.51 116.47,55.51 117.49,56.53 118.5,56.53 | 125.75,52.75 125.5,52.5 125.5,45.5 127,43 129.5,44 139.5,34.5 PWR.A 139.69,28.69 134,23 134,14 140.93,14 141,13.93 | 86.5,78 v91,78 | v94.85,84 94.85,75.02 95,75.02 95,71 96,71 v97,66.15 | v96,60.85 97,55.5 | 141,13.93 U$2.OUT+ | C20.1 129.1,8 141,8 141,13.93
(copper drawn outside any net)
  shapes: Top area x2